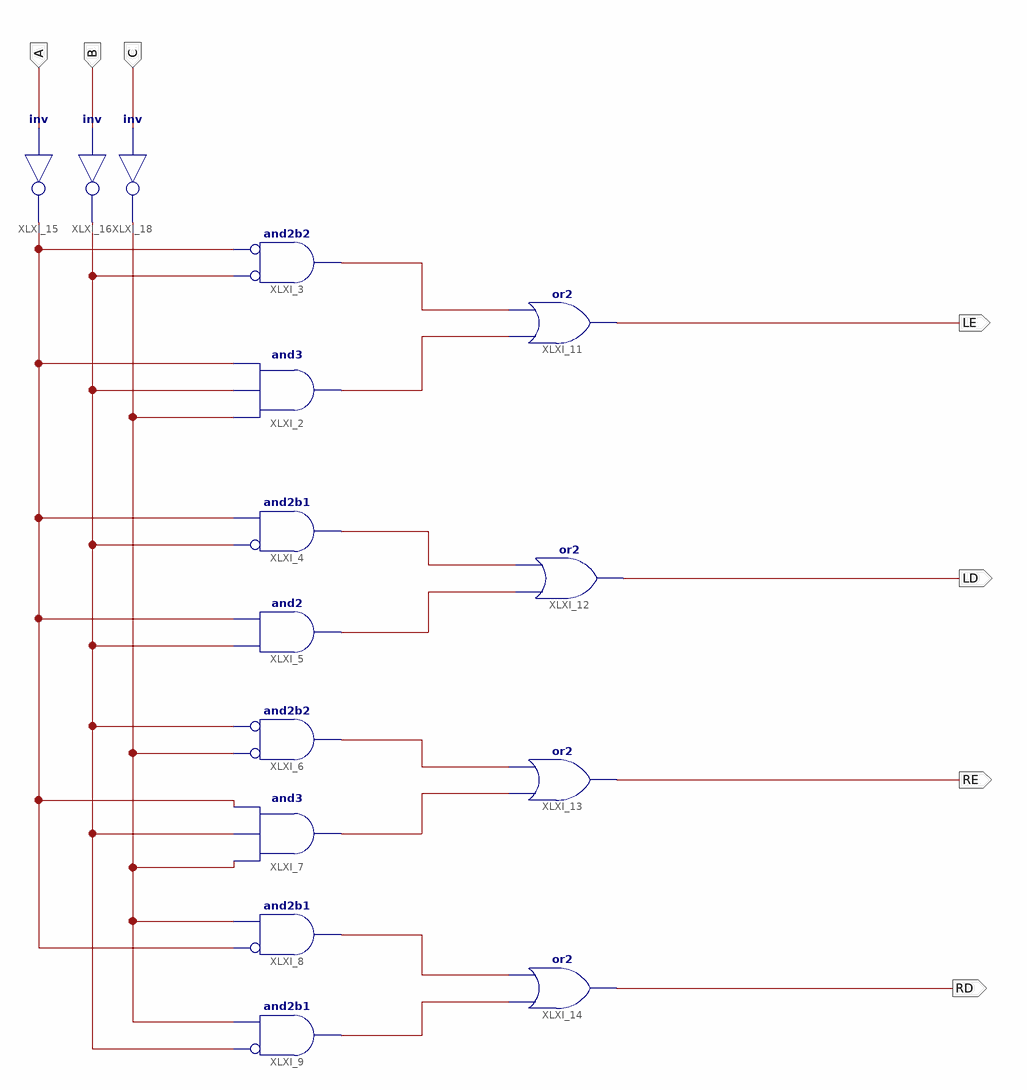
[diagram p0: schematic sheet 1]
// Xilinx ISE schematic section3_revised.sch (xc9500xl) as structural Verilog: 15 symbols, 7 ports
module section3_revised (
  input  A,
  input  B,
  input  C,
  output LE,
  output LD,
  output RE,
  output RD
);

  wire XLXN_3, XLXN_4, XLXN_6, XLXN_7, XLXN_8, XLXN_9, XLXN_10, XLXN_11, XLXN_27, XLXN_28, XLXN_30;

  and XLXI_2 (XLXN_4, XLXN_30, XLXN_28, XLXN_27);
  and XLXI_3 (XLXN_3, ~XLXN_28, ~XLXN_27);  // and2b2
  and XLXI_4 (XLXN_7, ~XLXN_28, XLXN_27);  // and2b1
  and XLXI_5 (XLXN_6, XLXN_28, XLXN_27);
  and XLXI_6 (XLXN_8, ~XLXN_30, ~XLXN_28);  // and2b2
  and XLXI_7 (XLXN_9, XLXN_30, XLXN_28, XLXN_27);
  and XLXI_8 (XLXN_10, ~XLXN_27, XLXN_30);  // and2b1
  and XLXI_9 (XLXN_11, ~XLXN_28, XLXN_30);  // and2b1
  or XLXI_11 (LE, XLXN_4, XLXN_3);
  or XLXI_12 (LD, XLXN_6, XLXN_7);
  or XLXI_13 (RE, XLXN_9, XLXN_8);
  or XLXI_14 (RD, XLXN_11, XLXN_10);
  not XLXI_15 (XLXN_27, A);
  not XLXI_16 (XLXN_28, B);
  not XLXI_18 (XLXN_30, C);
endmodule
